# Altium schematic sheet STM32F103C8_snippit.SchDoc
size B
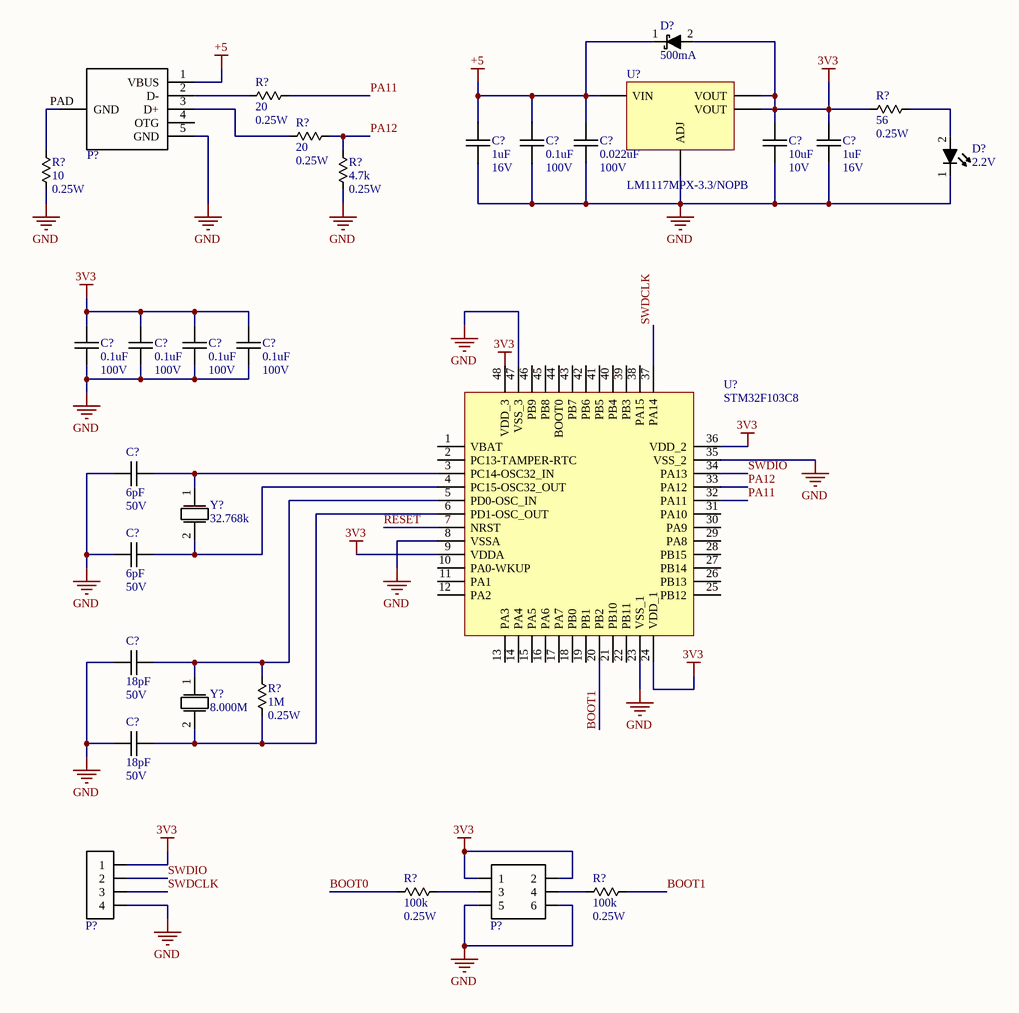
[diagram p0: STM32F103C8_snippit.SchDoc]

## Parts
(Parts that share a designator on the sheet are numbered #1, #2 ... from top to bottom, then left to right.)
C?#1  Capacitance: 1uF  Voltage Rating: 16V  [chip_0805]  (hidden comment: cap_single_np)
C?#2  Capacitance: 0.1uF  Voltage Rating: 100V  [chip_0603]  (hidden comment: cap_single_np)
C?#3  Capacitance: 0.022uF  Voltage Rating: 100V  [chip_0603]  (hidden comment: cap_single_np)
C?#4  Capacitance: 10uF  Voltage Rating: 10V  [chip_0805]  (hidden comment: cap_single_np)
C?#5  Capacitance: 1uF  Voltage Rating: 16V  [chip_0805]  (hidden comment: cap_single_np)
C?#6  Capacitance: 0.1uF  Voltage Rating: 100V  [chip_0603]  (hidden comment: cap_single_np)
C?#7  Capacitance: 0.1uF  Voltage Rating: 100V  [chip_0603]  (hidden comment: cap_single_np)
C?#8  Capacitance: 0.1uF  Voltage Rating: 100V  [chip_0603]  (hidden comment: cap_single_np)
C?#9  Capacitance: 0.1uF  Voltage Rating: 100V  [chip_0603]  (hidden comment: cap_single_np)
C?#10  Capacitance: 6pF  Voltage Rating: 50V  [chip_0603]  (hidden comment: cap_single_np)
C?#11  Capacitance: 6pF  Voltage Rating: 50V  [chip_0603]  (hidden comment: cap_single_np)
C?#12  Capacitance: 18pF  Voltage Rating: 50V  [chip_0603]  (hidden comment: cap_single_np)
C?#13  Capacitance: 18pF  Voltage Rating: 50V  [chip_0603]  (hidden comment: cap_single_np)
D?#1  Current Rating: 500mA  [sod323_0]  (hidden comment: diode_2)
D?#2  Forward Voltage: 2.2V  [chip_0603]  (hidden comment: diode_4)
P?#1  usb_micro_b  [10118192]  (value not drawn)
P?#2  conn-4x1_0  [HDDR_4x1_0]  (value not drawn)
P?#3  conn-3x2_0  [hddr_3x2_0]  (value not drawn)
R?#1  Resistance: 20  Power Rating: 0.25W  [chip_0603]  (hidden comment: res_single)
R?#2  Resistance: 56  Power Rating: 0.25W  [chip_0603]  (hidden comment: res_single)
R?#3  Resistance: 20  Power Rating: 0.25W  [chip_0603]  (hidden comment: res_single)
R?#4  Resistance: 10  Power Rating: 0.25W  [chip_0603]  (hidden comment: res_single)
R?#5  Resistance: 4.7k  Power Rating: 0.25W  [chip_0603]  (hidden comment: res_single)
R?#6  Resistance: 1M  Power Rating: 0.25W  [chip_0603]  (hidden comment: res_single)
R?#7  Resistance: 100k  Power Rating: 0.25W  [chip_0603]  (hidden comment: res_single)
R?#8  Resistance: 100k  Power Rating: 0.25W  [chip_0603]  (hidden comment: res_single)
U?#1  Manufacturer PN: LM1117MPX-3.3/NOPB  [sot-223-4]  (hidden comment: LM1117)
U?#2  STM32F103C8  [LQFP48_0]
Y?#1  Frequency: 32.768k  [ABS25_OSC]  (hidden comment: osc_xtal_2p_0)
Y?#2  Frequency: 8.000M  [ABLS_AT49_OSC]  (hidden comment: osc_xtal_2p_0)

## Nets
3V3: C?#4.1 C?#5.1 C?#6.2 C?#7.2 C?#8.1 C?#9.1 D?#1.2 P?#2.1 P?#3.1 P?#3.2 R?#2.1 U?#1.2(VOUT) U?#1.4(VOUT) U?#2.9(VDDA) U?#2.24(VDD_1) U?#2.36(VDD_2) U?#2.48(VDD_3)
+5: C?#1.1 C?#2.1 C?#3.1 D?#1.1 P?#1.1(VBUS) U?#1.3(VIN)
GND: C?#1.2 C?#2.2 C?#3.2 C?#4.2 C?#5.2 C?#6.1 C?#7.1 C?#8.2 C?#9.2 C?#10.1 C?#11.1 C?#12.2 C?#13.1 D?#2.1 P?#1.5(GND) P?#2.4 P?#3.5 P?#3.6 R?#4.2 R?#5.2 U?#1.2(ADJ) U?#2.8(VSSA) U?#2.23(VSS_1) U?#2.35(VSS_2) U?#2.47(VSS_3)
BOOT0: R?#7.1
BOOT1: R?#8.2 U?#2.20(PB2)
PA11: R?#1.2 U?#2.32(PA11)
PA12: R?#3.2 R?#5.1 U?#2.33(PA12)
RESET: U?#2.7(NRST)
SWDCLK: P?#2.3 U?#2.37(PA14)
SWDIO: P?#2.2 U?#2.34(PA13)
NetC?#10_2: C?#10.2 U?#2.3(PC14-OSC32_IN) Y?#1.1
NetC?#11_2: C?#11.2 U?#2.4(PC15-OSC32_OUT) Y?#1.2
NetC?#12_1: C?#12.1 R?#6.1 U?#2.5(PD0-OSC_IN) Y?#2.1
NetC?#13_2: C?#13.2 R?#6.2 U?#2.6(PD1-OSC_OUT) Y?#2.2
NetD?#2_2: D?#2.2 R?#2.2
NetP?#1_2: P?#1.2(D-) R?#1.1
NetP?#1_3: P?#1.3(D+) R?#3.1
NetP?#1_PAD: P?#1.PAD(GND) R?#4.1
NetP?#3_3: P?#3.3 R?#7.2
NetP?#3_4: P?#3.4 R?#8.1

Not connected (* = marked no-connect by the designer): P?#1 4(OTG); U?#2 1(VBAT) 2(PC13-TAMPER-RTC) 10(PA0-WKUP) 11(PA1) 12(PA2) 13(PA3) 14(PA4) 15(PA5) 16(PA6) 17(PA7) 18(PB0) 19(PB1) 21(PB10) 22(PB11) 25(PB12) 26(PB13) 27(PB14) 28(PB15) 29(PA8) 30(PA9) 31(PA10) 38(PA15) 39(PB3) 40(PB4) 41(PB5) 42(PB6) 43(PB7) 44(BOOT0) 45(PB8) 46(PB9)

## Library data of the parts
C?#1 C?#5 = CAP-00107: CAP, 1uF, 10%, 16V, X7R, 0805; Manufacturer: Murata; Manufacturer PN: GRM21BR71C105KA01L; Tolerance: 10%; Part Number: CAP-00107; Type: X7R
C?#2 C?#6-C?#9 = CAP-00530: CAP, 0.1uF, ±10%, 100V, X7R, 0603; Manufacturer: Murata; Manufacturer PN: GRM188R72A104KA35J; Tolerance: ±10%; Part Number: CAP-00530; Type: X7R
C?#3 = CAP-00524: CAP, 0.022uF, ±10%, 100V, X7R, 0603; Manufacturer: Murata; Manufacturer PN: GRM188R72A223KAC4D; Tolerance: ±10%; Part Number: CAP-00524; Type: X7R
C?#4 = CAP-00131: CAP, 10uF, 10%, 10V, X7R, 0805; Manufacturer: Murata; Manufacturer PN: GRM21BR71A106KA73L; Tolerance: 10%; Part Number: CAP-00131; Type: X7R
C?#10 C?#11 = CAP-00538: CAP, 6pF, ±10%, 50V, C0G, 0805; Tolerance: ±10%; Part Number: CAP-00538; Type: C0G
C?#12 C?#13 = CAP-00409: CAP, 18pF, ±2%, 50V, C0G, 0603; Manufacturer: Murata; Manufacturer PN: GRM1885C1H180GA01D; Tolerance: ±2%; Part Number: CAP-00409; Type: C0G
D?#1 = DIO-00000: Dio Shtky, 500mA, 0.62V, 30V, SOD-323; Manufacturer: ON Semi; Manufacturer PN: NSR0530HT1G; Forward Voltage: 620mV; Type: Schottky; Reverse Breakdown Voltage: 30V; Part Number: DIO-00000
D?#2 = DIO-00040: LED, Green, 0603, 20mA; Manufacturer: Rohm Semi; Manufacturer PN: SML-D12M8WT86; Reverse Breakdown Voltage: 5V; Power Rating: 54mW; Type: LED; Current Rating: 20mA; Part Number: DIO-00040; Cost: 0.34
P?#1 = CONN-00011: USB Micro B Type Receptacle; Manufacturer: Amphenol; Positions per level: 5; Levels: 1; Current: 1.8; Part Number: CONN-00011; Type: USB Micro B; Manufacturer PN: 10118192
P?#2 = CONN-00029: Header 4x1, 0.1"; Positions per level: 4; Levels: 1; Part Number: CONN-00029; Type: Header
P?#3 = CONN-00002: Header, 3x2, 0.1"; Manufacturer: Wurth Electronics Inc.; Manufacturer PN: 61300621121; Positions per level: 3; Levels: 2; Part Number: CONN-00002; Type: Header; Current: 3; Cost: 0.54
R?#1 R?#3 = RES-00129: RES SMD 20 OHM 1% 1/4W 0603; Manufacturer: Panasonic; Manufacturer PN: ERJ-PA3F20R0V; Tolerance: 1%; Part Number: RES-00129
R?#2 = RES-00159: RES SMD 56 OHM 1% 1/4W 0603; Manufacturer: Panasonic; Manufacturer PN: ERJ-PA3F56R0V; Tolerance: 1%; Part Number: RES-00159
R?#4 = RES-00116: RES SMD 10 OHM 1% 1/4W 0603; Manufacturer: Panasonic; Manufacturer PN: ERJ-PA3F10R0V; Tolerance: 1%; Part Number: RES-00116
R?#5 = RES-00470: RES SMD 4.7K OHM 1% 1/4W 0603; Manufacturer: Panasonic; Manufacturer PN: ERJ-PA3F4701V; Tolerance: 1%; Part Number: RES-00470
R?#6 = RES-00362: RES SMD 1M OHM 1% 1/4W 0603; Manufacturer: Panasonic; Manufacturer PN: ERJ-PA3F1004V; Tolerance: 1%; Part Number: RES-00362
R?#7 R?#8 = RES-00301: RES SMD 100K OHM 1% 1/4W 0603; Manufacturer: Panasonic; Manufacturer PN: ERJ-PA3F1003V; Tolerance: 1%; Part Number: RES-00301
U?#1 = PWREG-00018: REG, Linear, Fixed 3V3, 800mA, SOT-223; Manufacturer: TI; Voltage Range In: 4.5 - 15V; Voltage Range Out: 3.3V; Part Number: PWREG-00018; Max Current: 800mA; Reg Type: Linear; Fixed/Adj: Fixed; Cost: 1.14
U?#2 = UCTRL-00008: STM32 M3, LQFP-48; Manufacturer: ST; Manufacturer PN: STM32F103C8; Part Number: UCTRL-00008
Y?#1 = OSC-00003: XTAL, 32.768kHz, 6pF, 20ppm; Manufacturer: Abracon; Manufacturer PN: ABS25-32.768KHZ-6-T; ESR: 50k; Stability: *ppm; Load Capacitance: 6pF; Tolerance: 20ppm; Part Number: OSC-00003
Y?#2 = OSC-00002: XTAL, 8MHz, 18pF, 20ppm; Manufacturer: Abracon; Manufacturer PN: ABLS-8.000MHZ-B2-T; ESR: 80; Stability: 50ppm; Load Capacitance: 18pF; Tolerance: 20ppm; Part Number: OSC-00002